# EAGLE board Backplane (EAGLE 9.6.2), part 1 of 2
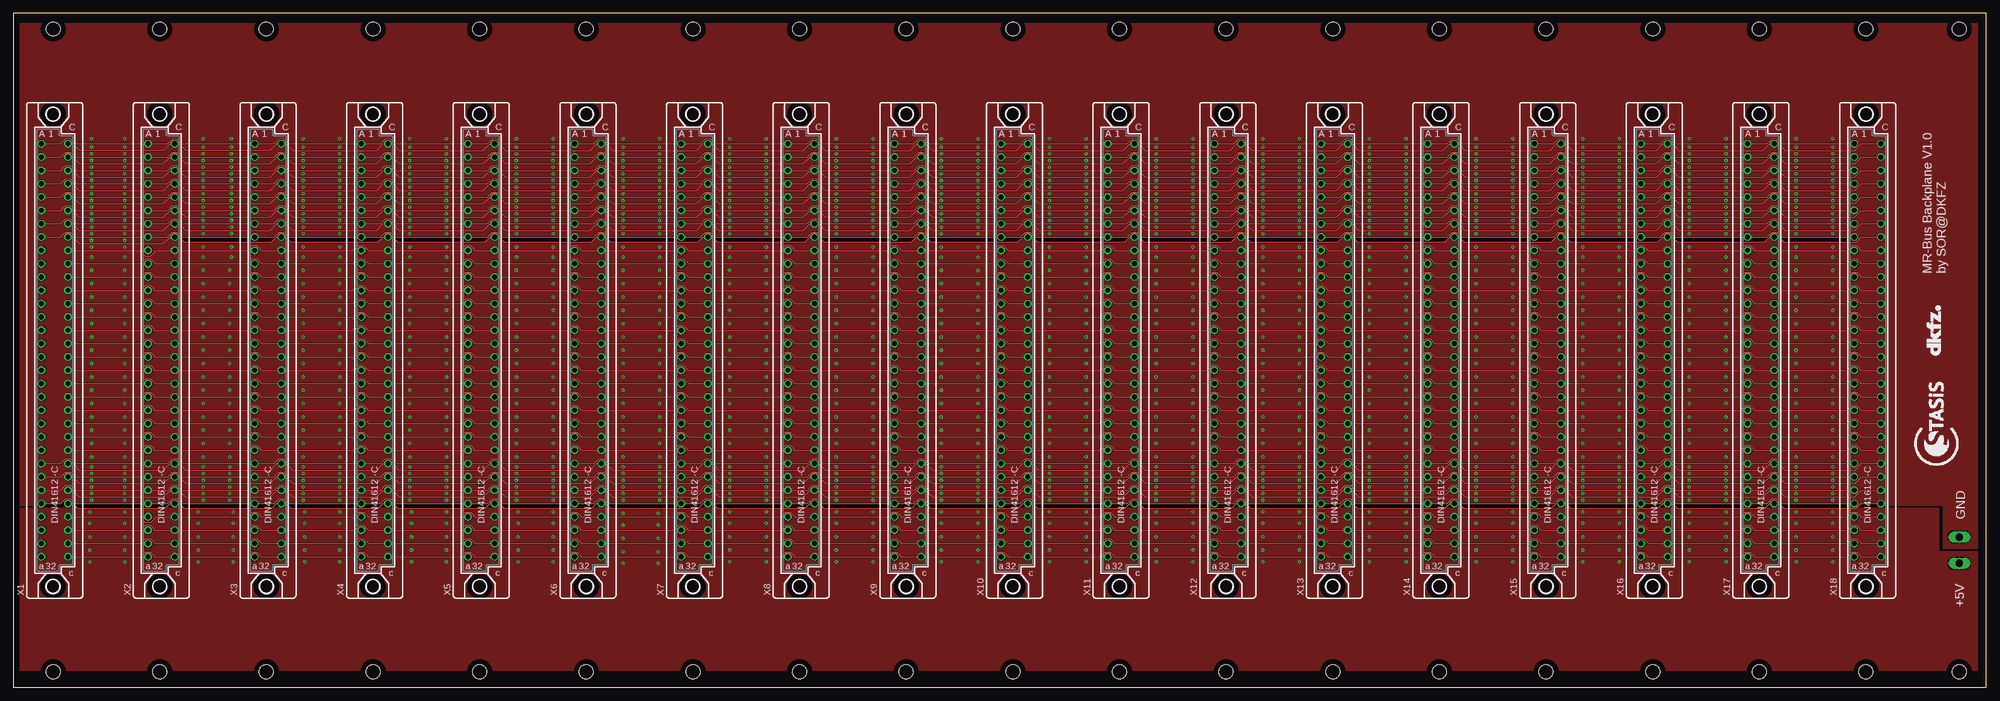
[diagram p2: board, top side]
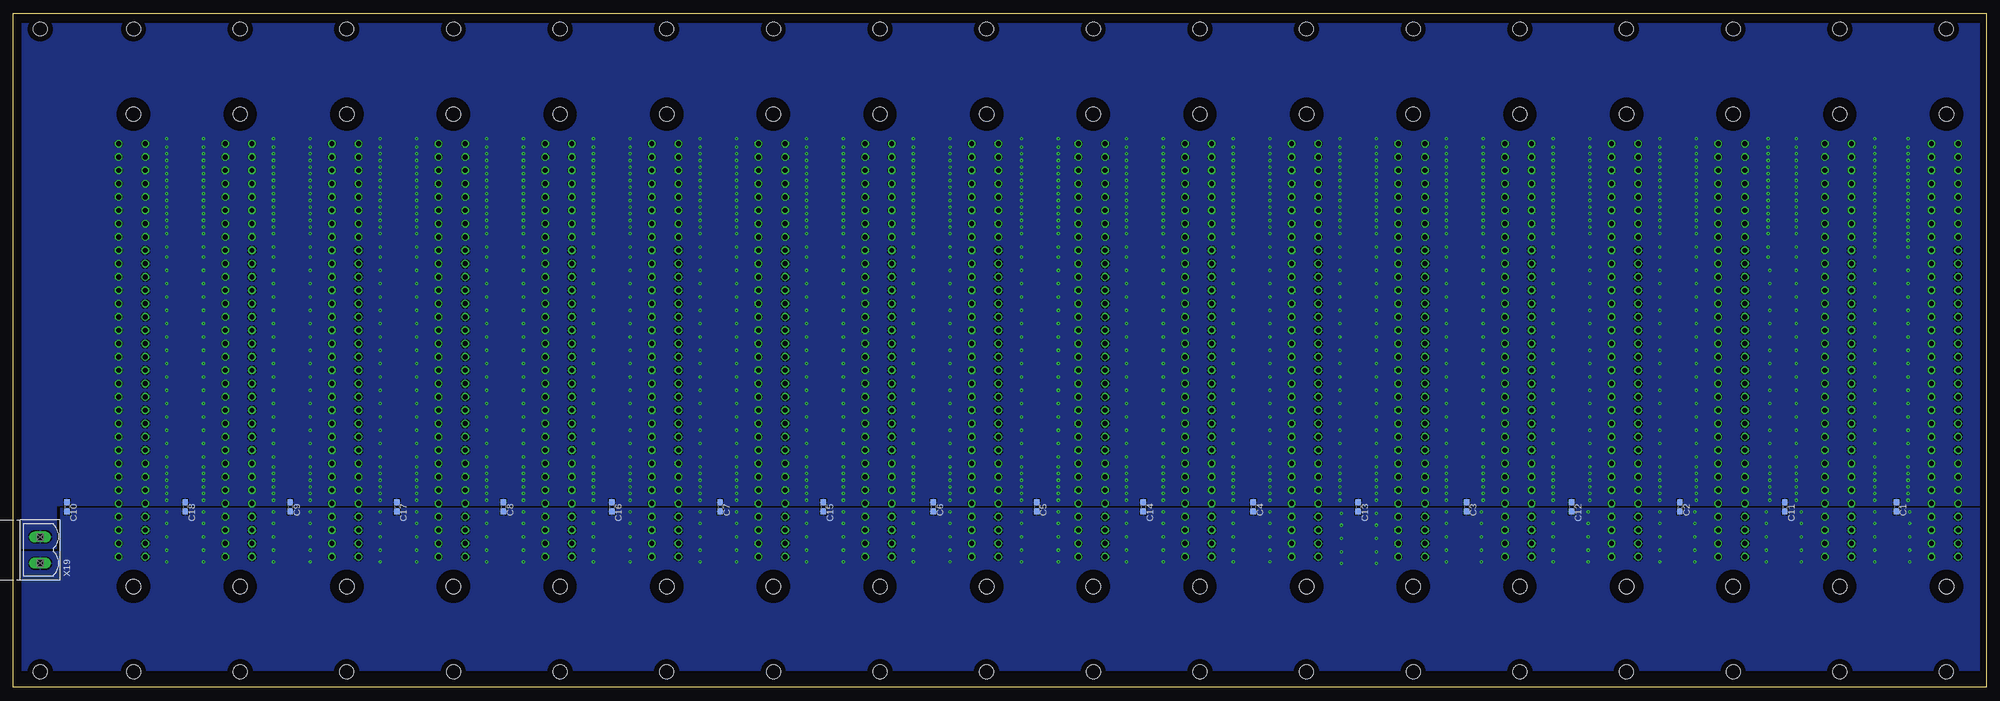
[diagram p3: board, bottom side, seen from below]

Size 376 x 128.55 mm. Coordinates in mm from the lower left corner, seen from the top.
Outline: 0,0 376,0 376,128.55 0,128.55 0,0
Copper layers (1*16): Top 0.035mm / dielectric 1.5mm / Bottom 0.035mm
Design rules "default *": minimum track width 6mil, minimum drill 0.2mm, track to track 4mil, track to pad 4mil, pad to pad 4mil, via to via 4mil, smd to smd 4mil, copper to edge 40mil, drill to drill 6mil, minimum pad ring 10mil, minimum via ring 8mil, stop-mask expansion 4mil, vias tented up to drill 8mil, thermal gap 10mil
Holes 2.7 mm at 7.62,3.03 27.94,3.03 48.26,3.03 68.58,3.03 88.9,3.03 109.22,3.03 129.54,3.03 149.86,3.03 170.18,3.03 190.5,3.03 210.82,3.03 231.14,3.03 251.46,3.03 271.78,3.03 292.1,3.03 312.42,3.03 332.74,3.03 353.06,3.03 370.84,3.03 7.62,125.53 27.94,125.53 48.26,125.53 68.58,125.53 88.9,125.53 109.22,125.53 129.54,125.53 149.86,125.53 170.18,125.53 190.5,125.53 210.82,125.53 231.14,125.53 251.46,125.53 271.78,125.53 292.1,125.53 312.42,125.53 332.74,125.53 353.06,125.53 370.84,125.53

## Footprints (pad centres in the part's own frame; a part is rotated, then mirrored left to right if it is on the bottom)
C0603 = smd 1.1 x 1: 1 -0.85,0; 2 0.85,0
FAC64S = drill 0.914 octagon: A1 -2.54,39.37; A2 -2.54,36.83; A3 -2.54,34.29; A4 -2.54,31.75; A5 -2.54,29.21; A6 -2.54,26.67; A7 -2.54,24.13; A8 -2.54,21.59; A9 -2.54,19.05; A10 -2.54,16.51; A11 -2.54,13.97; A12 -2.54,11.43; A13 -2.54,8.89; A14 -2.54,6.35; A15 -2.54,3.81; A16 -2.54,1.27; A17 -2.54,-1.27; A18 -2.54,-3.81; A19 -2.54,-6.35; A20 -2.54,-8.89; A21 -2.54,-11.43; A22 -2.54,-13.97; A23 -2.54,-16.51; A24 -2.54,-19.05; A25 -2.54,-21.59; A26 -2.54,-24.13; A27 -2.54,-26.67; A28 -2.54,-29.21; A29 -2.54,-31.75; A30 -2.54,-34.29; A31 -2.54,-36.83; A32 -2.54,-39.37; C1 2.54,39.37; C2 2.54,36.83; C3 2.54,34.29; C4 2.54,31.75; C5 2.54,29.21; C6 2.54,26.67; C7 2.54,24.13; C8 2.54,21.59; C9 2.54,19.05; C10 2.54,16.51; C11 2.54,13.97; C12 2.54,11.43; C13 2.54,8.89; C14 2.54,6.35; C15 2.54,3.81; C16 2.54,1.27; C17 2.54,-1.27; C18 2.54,-3.81; C19 2.54,-6.35; C20 2.54,-8.89; C21 2.54,-11.43; C22 2.54,-13.97; C23 2.54,-16.51; C24 2.54,-19.05; C25 2.54,-21.59; C26 2.54,-24.13; C27 2.54,-26.67; C28 2.54,-29.21; C29 2.54,-31.75; C30 2.54,-34.29; C31 2.54,-36.83; C32 2.54,-39.37 | hole 2.794: -0.305,45.009; -0.305,-45.009
MSTBV2 = drill 1.397 long: 1 -2.5,0; 2 2.5,0

## Placement (x,y rotation side)
C1  10nF  [C0603]  17.14,34.43 270 bottom
C2  10nF  [C0603]  58.42,34.43 270 bottom
C3  10nF  [C0603]  99.06,34.43 270 bottom
C4  10nF  [C0603]  139.7,34.43 270 bottom
C5  10nF  [C0603]  180.97,34.43 270 bottom
C6  10nF  [C0603]  200.66,34.43 270 bottom
C7  10nF  [C0603]  241.3,34.43 270 bottom
C8  10nF  [C0603]  282.57,34.43 270 bottom
C9  10nF  [C0603]  323.21,34.43 270 bottom
C10  10nF  [C0603]  365.76,34.43 270 bottom
C11  10nF  [C0603]  38.42,34.43 270 bottom
C12  10nF  [C0603]  79.06,34.43 270 bottom
C13  10nF  [C0603]  119.7,34.43 270 bottom
C14  10nF  [C0603]  160.66,34.43 270 bottom
C15  10nF  [C0603]  221.62,34.43 270 bottom
C16  10nF  [C0603]  261.94,34.43 270 bottom
C17  10nF  [C0603]  302.89,34.43 270 bottom
C18  10nF  [C0603]  343.22,34.43 270 bottom
U$1  [LOGO_STASIS]  366.71,51.26 90 top
U$2  [LOGO_DKFZ]  367.35,63.32 90 top
X1  FAC64S  [FAC64S]  7.92,64.28 0 top
X2  FAC64S  [FAC64S]  28.24,64.28 0 top
X3  FAC64S  [FAC64S]  48.56,64.28 0 top
X4  FAC64S  [FAC64S]  68.88,64.28 0 top
X5  FAC64S  [FAC64S]  89.2,64.28 0 top
X6  FAC64S  [FAC64S]  109.52,64.28 0 top
X7  FAC64S  [FAC64S]  129.84,64.28 0 top
X8  FAC64S  [FAC64S]  150.16,64.28 0 top
X9  FAC64S  [FAC64S]  170.48,64.28 0 top
X10  FAC64S  [FAC64S]  190.8,64.28 0 top
X11  FAC64S  [FAC64S]  211.12,64.28 0 top
X12  FAC64S  [FAC64S]  231.44,64.28 0 top
X13  FAC64S  [FAC64S]  251.76,64.28 0 top
X14  FAC64S  [FAC64S]  272.08,64.28 0 top
X15  FAC64S  [FAC64S]  292.4,64.28 0 top
X16  FAC64S  [FAC64S]  312.72,64.28 0 top
X17  FAC64S  [FAC64S]  333.04,64.28 0 top
X18  FAC64S  [FAC64S]  353.36,64.28 0 top
X19  AKL320-2  [MSTBV2]  370.84,26.18 90 bottom

## Tracks (layer width: path | path; a pad name or v marks a point on that pad's centre or on a via)
5V  (via drill 0.2)
  other vias: 14.61,33.48 21.27,33.48 14.61,31.26 21.27,31.26 21.27,28.72 14.61,28.72 14.61,26.18 21.27,26.18 14.61,23.95 21.27,23.95 35.24,33.48 41.91,33.48 35.24,31.26 41.91,31.26 41.91,28.72 35.24,28.72 35.24,26.18 41.91,26.18 35.24,23.95 41.91,23.95 55.56,33.48 62.23,33.48 55.56,31.26 62.23,31.26 62.23,28.72 55.56,28.72 55.56,26.18 62.23,26.18 55.56,23.95 62.23,23.95 75.88,33.48 82.55,33.48 75.88,31.26 82.55,31.26 82.55,28.72 75.88,28.72 75.88,26.18 82.55,26.18 75.88,23.95 82.55,23.95 96.2,33.48 102.87,33.48 96.2,31.26 102.87,31.26 102.87,28.72 96.2,28.72 96.2,26.18 102.87,26.18 96.2,23.95 102.87,23.95 116.2,33.16 122.87,33.16 116.2,30.94 122.87,30.94 122.87,28.4 116.2,28.4 116.2,25.86 122.87,25.86 116.2,23.64 122.87,23.64 136.53,33.48 143.51,33.48 136.53,31.26 143.51,31.26 143.51,28.72 136.53,28.72 136.53,26.18 143.51,26.18 136.53,23.95 143.51,23.95 156.84,33.48 163.83,33.48 156.84,31.26 163.83,31.26 163.83,28.72 156.84,28.72 156.84,26.18 163.83,26.18 156.84,23.95 163.83,23.95 176.85,33.48 183.83,33.48 176.85,31.26 183.83,31.26 183.83,28.72 176.85,28.72 176.85,26.18 183.83,26.18 176.85,23.95 183.83,23.95 197.49,33.48 204.47,33.48 197.49,31.26 204.47,31.26 204.47,28.72 197.49,28.72 197.49,26.18 204.47,26.18 197.49,23.95 204.47,23.95 217.81,33.48 224.79,33.48 217.81,31.26 224.79,31.26 224.79,28.72 217.81,28.72 217.81,26.18 224.79,26.18 217.81,23.95 224.79,23.95 238.12,33.48 245.11,33.48 238.12,31.26 245.11,31.26 245.11,28.72 238.12,28.72 238.12,26.18 245.11,26.18 238.12,23.95 245.11,23.95 258.44,33.48 265.43,33.48 258.44,31.26 265.43,31.26 265.43,28.72 258.44,28.72 258.44,26.18 265.43,26.18 258.44,23.95 265.43,23.95 278.76,33.48 285.75,33.48 278.76,31.26 285.75,31.26 285.75,28.72 278.76,28.72 278.76,26.18 285.75,26.18 278.76,23.95 285.75,23.95 299.08,33.48 306.07,33.48 299.08,31.26 306.07,31.26 306.07,28.72 299.08,28.72 299.08,26.18 306.07,26.18 299.08,23.95 306.07,23.95 319.4,33.48 326.39,33.48 319.4,31.26 326.39,31.26 326.39,28.72 319.4,28.72 319.4,26.18 326.39,26.18 319.4,23.95 326.39,23.95 339.73,33.48 346.71,33.48 339.73,31.26 346.71,31.26 346.71,28.72 339.73,28.72 339.73,26.18 346.71,26.18 339.73,23.95 346.71,23.95
  pour Bottom: 374.33,3.32 1.27,3.32 1.27,34.11 367.03,34.11 367.03,25.86 374.33,25.86
  pour Top: 1.27,34.11 1.27,3.32 374.33,3.32 374.33,25.86 367.03,25.86 367.03,34.11
A6
  Top 0.2: X1.A6 9.1,90.95 10.06,91.91 10.86,91.91 11.82,90.95 X2.A6 29.42,90.95 30.38,91.91 31.18,91.91 32.14,90.95 X3.A6 49.74,90.95 50.7,91.91 51.5,91.91 52.46,90.95 X4.A6 70.06,90.95 71.02,91.91 71.82,91.91 72.78,90.95 X5.A6 90.38,90.95 91.34,91.91 92.14,91.91 93.1,90.95 X6.A6 110.7,90.95 111.66,91.91 112.46,91.91 113.42,90.95 X7.A6 131.02,90.95 131.98,91.91 132.78,91.91 133.74,90.95 X8.A6 151.34,90.95 152.3,91.91 153.1,91.91 154.06,90.95 X9.A6 171.66,90.95 172.62,91.91 173.42,91.91 174.38,90.95 X10.A6 191.98,90.95 192.94,91.91 193.74,91.91 194.7,90.95 X11.A6 212.3,90.95 213.26,91.91 214.06,91.91 215.02,90.95 X12.A6 232.62,90.95 233.58,91.91 234.38,91.91 235.34,90.95 X13.A6 252.94,90.95 253.9,91.91 254.7,91.91 255.66,90.95 X14.A6 273.26,90.95 274.22,91.91 275.02,91.91 275.98,90.95 X15.A6 293.58,90.95 294.54,91.91 295.34,91.91 296.3,90.95 X16.A6 313.9,90.95 314.86,91.91 315.66,91.91 316.62,90.95 X17.A6 334.22,90.95 335.18,91.91 335.98,91.91 336.94,90.95 X18.A6
A7
  Top 0.2: X1.A7 9.1,88.41 10.06,89.37 10.86,89.37 11.82,88.41 X2.A7 29.42,88.41 30.38,89.37 31.18,89.37 32.14,88.41 X3.A7 49.74,88.41 50.7,89.37 51.5,89.37 52.46,88.41 X4.A7 70.06,88.41 71.02,89.37 71.82,89.37 72.78,88.41 X5.A7 90.38,88.41 91.34,89.37 92.14,89.37 93.1,88.41 X6.A7 110.7,88.41 111.66,89.37 112.46,89.37 113.42,88.41 X7.A7 131.02,88.41 131.98,89.37 132.78,89.37 133.74,88.41 X8.A7 151.34,88.41 152.3,89.37 153.1,89.37 154.06,88.41 X9.A7 171.66,88.41 172.62,89.37 173.42,89.37 174.38,88.41 X10.A7 191.98,88.41 192.94,89.37 193.74,89.37 194.7,88.41 X11.A7 212.3,88.41 213.26,89.37 214.06,89.37 215.02,88.41 X12.A7 232.62,88.41 233.58,89.37 234.38,89.37 235.34,88.41 X13.A7 252.94,88.41 253.9,89.37 254.7,89.37 255.66,88.41 X14.A7 273.26,88.41 274.22,89.37 275.02,89.37 275.98,88.41 X15.A7 293.58,88.41 294.54,89.37 295.34,89.37 296.3,88.41 X16.A7 313.9,88.41 314.86,89.37 315.66,89.37 316.62,88.41 X17.A7 334.22,88.41 335.18,89.37 335.98,89.37 336.94,88.41 X18.A7
A25
  Top 0.2: X1.A25 9.1,42.69 10.06,43.65 10.86,43.65 11.82,42.69 X2.A25 29.42,42.69 30.38,43.65 31.18,43.65 32.14,42.69 X3.A25 49.74,42.69 50.7,43.65 51.5,43.65 52.46,42.69 X4.A25 70.06,42.69 71.02,43.65 71.82,43.65 72.78,42.69 X5.A25 90.38,42.69 91.34,43.65 92.14,43.65 93.1,42.69 X6.A25 110.7,42.69 111.66,43.65 112.46,43.65 113.42,42.69 X7.A25 131.02,42.69 131.98,43.65 132.78,43.65 133.74,42.69 X8.A25 151.34,42.69 152.3,43.65 153.1,43.65 154.06,42.69 X9.A25 171.66,42.69 172.62,43.65 173.42,43.65 174.38,42.69 X10.A25 191.98,42.69 192.94,43.65 193.74,43.65 194.7,42.69 X11.A25 212.3,42.69 213.26,43.65 214.06,43.65 215.02,42.69 X12.A25 232.62,42.69 233.58,43.65 234.38,43.65 235.34,42.69 X13.A25 252.94,42.69 253.9,43.65 254.7,43.65 255.66,42.69 X14.A25 273.26,42.69 274.22,43.65 275.02,43.65 275.98,42.69 X15.A25 293.58,42.69 294.54,43.65 295.34,43.65 296.3,42.69 X16.A25 313.9,42.69 314.86,43.65 315.66,43.65 316.62,42.69 X17.A25 334.22,42.69 335.18,43.65 335.98,43.65 336.94,42.69 X18.A25
ADDR0
  Top 0.2: X1.C17 24.34,63.01 25.3,63.97 26.1,63.97 27.06,63.01 X2.C17 44.66,63.01 45.62,63.97 46.42,63.97 47.38,63.01 X3.C17 64.98,63.01 65.94,63.97 66.74,63.97 67.7,63.01 X4.C17 85.3,63.01 86.26,63.97 87.06,63.97 88.02,63.01 X5.C17 105.62,63.01 106.58,63.97 107.38,63.97 108.34,63.01 X6.C17 125.94,63.01 126.9,63.97 127.7,63.97 128.66,63.01 X7.C17 146.26,63.01 147.22,63.97 148.02,63.97 148.98,63.01 X8.C17 166.58,63.01 167.54,63.97 168.34,63.97 169.3,63.01 X9.C17 186.9,63.01 187.86,63.97 188.66,63.97 189.62,63.01 X10.C17 207.22,63.01 208.18,63.97 208.98,63.97 209.94,63.01 X11.C17 227.54,63.01 228.5,63.97 229.3,63.97 230.26,63.01 X12.C17 247.86,63.01 248.82,63.97 249.62,63.97 250.58,63.01 X13.C17 268.18,63.01 269.14,63.97 269.94,63.97 270.9,63.01 X14.C17 288.5,63.01 289.46,63.97 290.26,63.97 291.22,63.01 X15.C17 308.82,63.01 309.78,63.97 310.58,63.97 311.54,63.01 X16.C17 329.14,63.01 330.1,63.97 330.9,63.97 331.86,63.01 X17.C17 349.46,63.01 350.42,63.97 351.22,63.97 352.18,63.01 X18.C17
ADDR1
  Top 0.2: X1.C18 24.34,60.47 25.3,61.43 26.1,61.43 27.06,60.47 X2.C18 44.66,60.47 45.62,61.43 46.42,61.43 47.38,60.47 X3.C18 64.98,60.47 65.94,61.43 66.74,61.43 67.7,60.47 X4.C18 85.3,60.47 86.26,61.43 87.06,61.43 88.02,60.47 X5.C18 105.62,60.47 106.58,61.43 107.38,61.43 108.34,60.47 X6.C18 125.94,60.47 126.9,61.43 127.7,61.43 128.66,60.47 X7.C18 146.26,60.47 147.22,61.43 148.02,61.43 148.98,60.47 X8.C18 166.58,60.47 167.54,61.43 168.34,61.43 169.3,60.47 X9.C18 186.9,60.47 187.86,61.43 188.66,61.43 189.62,60.47 X10.C18 207.22,60.47 208.18,61.43 208.98,61.43 209.94,60.47 X11.C18 227.54,60.47 228.5,61.43 229.3,61.43 230.26,60.47 X12.C18 247.86,60.47 248.82,61.43 249.62,61.43 250.58,60.47 X13.C18 268.18,60.47 269.14,61.43 269.94,61.43 270.9,60.47 X14.C18 288.5,60.47 289.46,61.43 290.26,61.43 291.22,60.47 X15.C18 308.82,60.47 309.78,61.43 310.58,61.43 311.54,60.47 X16.C18 329.14,60.47 330.1,61.43 330.9,61.43 331.86,60.47 X17.C18 349.46,60.47 350.42,61.43 351.22,61.43 352.18,60.47 X18.C18
ADDR2
  Top 0.2: X1.C19 24.34,57.93 25.3,58.89 26.1,58.89 27.06,57.93 X2.C19 44.66,57.93 45.62,58.89 46.42,58.89 47.38,57.93 X3.C19 64.98,57.93 65.94,58.89 66.74,58.89 67.7,57.93 X4.C19 85.3,57.93 86.26,58.89 87.06,58.89 88.02,57.93 X5.C19 105.62,57.93 106.58,58.89 107.38,58.89 108.34,57.93 X6.C19 125.94,57.93 126.9,58.89 127.7,58.89 128.66,57.93 X7.C19 146.26,57.93 147.22,58.89 148.02,58.89 148.98,57.93 X8.C19 166.58,57.93 167.54,58.89 168.34,58.89 169.3,57.93 X9.C19 186.9,57.93 187.86,58.89 188.66,58.89 189.62,57.93 X10.C19 207.22,57.93 208.18,58.89 208.98,58.89 209.94,57.93 X11.C19 227.54,57.93 228.5,58.89 229.3,58.89 230.26,57.93 X12.C19 247.86,57.93 248.82,58.89 249.62,58.89 250.58,57.93 X13.C19 268.18,57.93 269.14,58.89 269.94,58.89 270.9,57.93 X14.C19 288.5,57.93 289.46,58.89 290.26,58.89 291.22,57.93 X15.C19 308.82,57.93 309.78,58.89 310.58,58.89 311.54,57.93 X16.C19 329.14,57.93 330.1,58.89 330.9,58.89 331.86,57.93 X17.C19 349.46,57.93 350.42,58.89 351.22,58.89 352.18,57.93 X18.C19
ADDR3
  Top 0.2: X1.C20 24.34,55.39 25.3,56.35 26.1,56.35 27.06,55.39 X2.C20 44.66,55.39 45.62,56.35 46.42,56.35 47.38,55.39 X3.C20 64.98,55.39 65.94,56.35 66.74,56.35 67.7,55.39 X4.C20 85.3,55.39 86.26,56.35 87.06,56.35 88.02,55.39 X5.C20 105.62,55.39 106.58,56.35 107.38,56.35 108.34,55.39 X6.C20 125.94,55.39 126.9,56.35 127.7,56.35 128.66,55.39 X7.C20 146.26,55.39 147.22,56.35 148.02,56.35 148.98,55.39 X8.C20 166.58,55.39 167.54,56.35 168.34,56.35 169.3,55.39 X9.C20 186.9,55.39 187.86,56.35 188.66,56.35 189.62,55.39 X10.C20 207.22,55.39 208.18,56.35 208.98,56.35 209.94,55.39 X11.C20 227.54,55.39 228.5,56.35 229.3,56.35 230.26,55.39 X12.C20 247.86,55.39 248.82,56.35 249.62,56.35 250.58,55.39 X13.C20 268.18,55.39 269.14,56.35 269.94,56.35 270.9,55.39 X14.C20 288.5,55.39 289.46,56.35 290.26,56.35 291.22,55.39 X15.C20 308.82,55.39 309.78,56.35 310.58,56.35 311.54,55.39 X16.C20 329.14,55.39 330.1,56.35 330.9,56.35 331.86,55.39 X17.C20 349.46,55.39 350.42,56.35 351.22,56.35 352.18,55.39 X18.C20
ADDR4
  Top 0.2: X1.C21 24.34,52.85 25.3,53.81 26.1,53.81 27.06,52.85 X2.C21 44.66,52.85 45.62,53.81 46.42,53.81 47.38,52.85 X3.C21 64.98,52.85 65.94,53.81 66.74,53.81 67.7,52.85 X4.C21 85.3,52.85 86.26,53.81 87.06,53.81 88.02,52.85 X5.C21 105.62,52.85 106.58,53.81 107.38,53.81 108.34,52.85 X6.C21 125.94,52.85 126.9,53.81 127.7,53.81 128.66,52.85 X7.C21 146.26,52.85 147.22,53.81 148.02,53.81 148.98,52.85 X8.C21 166.58,52.85 167.54,53.81 168.34,53.81 169.3,52.85 X9.C21 186.9,52.85 187.86,53.81 188.66,53.81 189.62,52.85 X10.C21 207.22,52.85 208.18,53.81 208.98,53.81 209.94,52.85 X11.C21 227.54,52.85 228.5,53.81 229.3,53.81 230.26,52.85 X12.C21 247.86,52.85 248.82,53.81 249.62,53.81 250.58,52.85 X13.C21 268.18,52.85 269.14,53.81 269.94,53.81 270.9,52.85 X14.C21 288.5,52.85 289.46,53.81 290.26,53.81 291.22,52.85 X15.C21 308.82,52.85 309.78,53.81 310.58,53.81 311.54,52.85 X16.C21 329.14,52.85 330.1,53.81 330.9,53.81 331.86,52.85 X17.C21 349.46,52.85 350.42,53.81 351.22,53.81 352.18,52.85 X18.C21
ADDR5
  Top 0.2: X1.C22 24.34,50.31 25.3,51.27 26.1,51.27 27.06,50.31 X2.C22 44.66,50.31 45.62,51.27 46.42,51.27 47.38,50.31 X3.C22 64.98,50.31 65.94,51.27 66.74,51.27 67.7,50.31 X4.C22 85.3,50.31 86.26,51.27 87.06,51.27 88.02,50.31 X5.C22 105.62,50.31 106.58,51.27 107.38,51.27 108.34,50.31 X6.C22 125.94,50.31 126.9,51.27 127.7,51.27 128.66,50.31 X7.C22 146.26,50.31 147.22,51.27 148.02,51.27 148.98,50.31 X8.C22 166.58,50.31 167.54,51.27 168.34,51.27 169.3,50.31 X9.C22 186.9,50.31 187.86,51.27 188.66,51.27 189.62,50.31 X10.C22 207.22,50.31 208.18,51.27 208.98,51.27 209.94,50.31 X11.C22 227.54,50.31 228.5,51.27 229.3,51.27 230.26,50.31 X12.C22 247.86,50.31 248.82,51.27 249.62,51.27 250.58,50.31 X13.C22 268.18,50.31 269.14,51.27 269.94,51.27 270.9,50.31 X14.C22 288.5,50.31 289.46,51.27 290.26,51.27 291.22,50.31 X15.C22 308.82,50.31 309.78,51.27 310.58,51.27 311.54,50.31 X16.C22 329.14,50.31 330.1,51.27 330.9,51.27 331.86,50.31 X17.C22 349.46,50.31 350.42,51.27 351.22,51.27 352.18,50.31 X18.C22
ADDR6
  Top 0.2: X1.C23 24.34,47.77 25.3,48.73 26.1,48.73 27.06,47.77 X2.C23 44.66,47.77 45.62,48.73 46.42,48.73 47.38,47.77 X3.C23 64.98,47.77 65.94,48.73 66.74,48.73 67.7,47.77 X4.C23 85.3,47.77 86.26,48.73 87.06,48.73 88.02,47.77 X5.C23 105.62,47.77 106.58,48.73 107.38,48.73 108.34,47.77 X6.C23 125.94,47.77 126.9,48.73 127.7,48.73 128.66,47.77 X7.C23 146.26,47.77 147.22,48.73 148.02,48.73 148.98,47.77 X8.C23 166.58,47.77 167.54,48.73 168.34,48.73 169.3,47.77 X9.C23 186.9,47.77 187.86,48.73 188.66,48.73 189.62,47.77 X10.C23 207.22,47.77 208.18,48.73 208.98,48.73 209.94,47.77 X11.C23 227.54,47.77 228.5,48.73 229.3,48.73 230.26,47.77 X12.C23 247.86,47.77 248.82,48.73 249.62,48.73 250.58,47.77 X13.C23 268.18,47.77 269.14,48.73 269.94,48.73 270.9,47.77 X14.C23 288.5,47.77 289.46,48.73 290.26,48.73 291.22,47.77 X15.C23 308.82,47.77 309.78,48.73 310.58,48.73 311.54,47.77 X16.C23 329.14,47.77 330.1,48.73 330.9,48.73 331.86,47.77 X17.C23 349.46,47.77 350.42,48.73 351.22,48.73 352.18,47.77 X18.C23
ADDR7
  Top 0.2: X1.C24 24.34,45.23 25.3,46.19 26.1,46.19 27.06,45.23 X2.C24 44.66,45.23 45.62,46.19 46.42,46.19 47.38,45.23 X3.C24 64.98,45.23 65.94,46.19 66.74,46.19 67.7,45.23 X4.C24 85.3,45.23 86.26,46.19 87.06,46.19 88.02,45.23 X5.C24 105.62,45.23 106.58,46.19 107.38,46.19 108.34,45.23 X6.C24 125.94,45.23 126.9,46.19 127.7,46.19 128.66,45.23 X7.C24 146.26,45.23 147.22,46.19 148.02,46.19 148.98,45.23 X8.C24 166.58,45.23 167.54,46.19 168.34,46.19 169.3,45.23 X9.C24 186.9,45.23 187.86,46.19 188.66,46.19 189.62,45.23 X10.C24 207.22,45.23 208.18,46.19 208.98,46.19 209.94,45.23 X11.C24 227.54,45.23 228.5,46.19 229.3,46.19 230.26,45.23 X12.C24 247.86,45.23 248.82,46.19 249.62,46.19 250.58,45.23 X13.C24 268.18,45.23 269.14,46.19 269.94,46.19 270.9,45.23 X14.C24 288.5,45.23 289.46,46.19 290.26,46.19 291.22,45.23 X15.C24 308.82,45.23 309.78,46.19 310.58,46.19 311.54,45.23 X16.C24 329.14,45.23 330.1,46.19 330.9,46.19 331.86,45.23 X17.C24 349.46,45.23 350.42,46.19 351.22,46.19 352.18,45.23 X18.C24
C31
  Top 0.2: X1.C31 24.34,27.45 25.3,28.41 26.1,28.41 27.06,27.45 X2.C31 44.66,27.45 45.62,28.41 46.42,28.41 47.38,27.45 X3.C31 64.98,27.45 65.94,28.41 66.74,28.41 67.7,27.45 X4.C31 85.3,27.45 86.26,28.41 87.06,28.41 88.02,27.45 X5.C31 105.62,27.45 106.58,28.41 107.38,28.41 108.34,27.45 X6.C31 125.94,27.45 126.9,28.41 127.7,28.41 128.66,27.45 X7.C31 146.26,27.45 147.22,28.41 148.02,28.41 148.98,27.45 X8.C31 166.58,27.45 167.54,28.41 168.34,28.41 169.3,27.45 X9.C31 186.9,27.45 187.86,28.41 188.66,28.41 189.62,27.45 X10.C31 207.22,27.45 208.18,28.41 208.98,28.41 209.94,27.45 X11.C31 227.54,27.45 228.5,28.41 229.3,28.41 230.26,27.45 X12.C31 247.86,27.45 248.82,28.41 249.62,28.41 250.58,27.45 X13.C31 268.18,27.45 269.14,28.41 269.94,28.41 270.9,27.45 X14.C31 288.5,27.45 289.46,28.41 290.26,28.41 291.22,27.45 X15.C31 308.82,27.45 309.78,28.41 310.58,28.41 311.54,27.45 X16.C31 329.14,27.45 330.1,28.41 330.9,28.41 331.86,27.45 X17.C31 349.46,27.45 350.42,28.41 351.22,28.41 352.18,27.45 X18.C31
CHIP0
  Top 0.2: X1.C25 11.32,42.69 12.61,41.4 28.64,41.4 29.92,42.69 X2.C25 31.64,42.69 32.92,41.4 48.95,41.4 50.24,42.69 X3.C25 51.96,42.69 53.24,41.4 69.28,41.4 70.56,42.69 X4.C25 72.28,42.69 73.56,41.4 89.59,41.4 90.88,42.69 X5.C25 92.6,42.69 93.89,41.4 109.92,41.4 111.2,42.69 X6.C25 112.92,42.69 114.2,41.4 130.24,41.4 131.52,42.69 X7.C25 133.24,42.69 134.53,41.4 150.56,41.4 151.84,42.69 X8.C25 153.56,42.69 154.84,41.4 170.88,41.4 172.16,42.69 X9.C25 173.88,42.69 175.16,41.4 191.19,41.4 192.48,42.69 X10.C25 194.2,42.69 195.49,41.4 211.51,41.4 212.8,42.69 X11.C25 214.52,42.69 215.81,41.4 231.84,41.4 233.12,42.69 X12.C25 234.84,42.69 236.12,41.4 252.16,41.4 253.44,42.69 X13.C25 255.16,42.69 256.44,41.4 272.48,41.4 273.76,42.69 X14.C25 275.48,42.69 276.76,41.4 292.8,41.4 294.08,42.69 X15.C25 295.8,42.69 297.08,41.4 313.12,41.4 314.4,42.69 X16.C25 316.12,42.69 317.4,41.4 333.44,41.4 334.72,42.69 X17.C25 336.44,42.69 337.73,41.4 350.9,41.4 352.18,42.69 X18.C25
CHIP1
  Top 0.2: X1.C26 11.32,40.15 12.61,38.86 28.64,38.86 29.92,40.15 X2.C26 31.64,40.15 32.92,38.86 48.95,38.86 50.24,40.15 X3.C26 51.96,40.15 53.24,38.86 69.28,38.86 70.56,40.15 X4.C26 72.28,40.15 73.56,38.86 89.59,38.86 90.88,40.15 X5.C26 92.6,40.15 93.89,38.86 109.92,38.86 111.2,40.15 X6.C26 112.92,40.15 114.2,38.86 130.24,38.86 131.52,40.15 X7.C26 133.24,40.15 134.53,38.86 150.56,38.86 151.84,40.15 X8.C26 153.56,40.15 154.84,38.86 170.88,38.86 172.16,40.15 X9.C26 173.88,40.15 175.16,38.86 191.19,38.86 192.48,40.15 X10.C26 194.2,40.15 195.49,38.86 211.51,38.86 212.8,40.15 X11.C26 214.52,40.15 215.81,38.86 231.84,38.86 233.12,40.15 X12.C26 234.84,40.15 236.12,38.86 252.16,38.86 253.44,40.15 X13.C26 255.16,40.15 256.44,38.86 272.48,38.86 273.76,40.15 X14.C26 275.48,40.15 276.76,38.86 292.8,38.86 294.08,40.15 X15.C26 295.8,40.15 297.08,38.86 313.12,38.86 314.4,40.15 X16.C26 316.12,40.15 317.4,38.86 333.44,38.86 334.72,40.15 X17.C26 336.44,40.15 337.73,38.86 350.9,38.86 352.18,40.15 X18.C26
CLK
  Top 0.2: X1.C29 24.13,32.53 25.21,31.45 26.19,31.45 27.27,32.53 X2.C29 44.66,32.53 45.62,33.49 46.42,33.49 47.38,32.53 X3.C29 64.98,32.53 65.94,33.49 66.74,33.49 67.7,32.53 X4.C29 85.3,32.53 86.26,33.49 87.06,33.49 88.02,32.53 X5.C29 105.62,32.53 106.58,33.49 107.38,33.49 108.34,32.53 X6.C29 125.94,32.53 126.9,33.49 127.7,33.49 128.66,32.53 X7.C29 146.26,32.53 147.22,33.49 148.02,33.49 148.98,32.53 X8.C29 166.58,32.53 167.54,33.49 168.34,33.49 169.3,32.53 X9.C29 186.9,32.53 187.86,33.49 188.66,33.49 189.62,32.53 X10.C29 207.22,32.53 208.18,33.49 208.98,33.49 209.94,32.53 X11.C29 227.54,32.53 228.5,33.49 229.3,33.49 230.26,32.53 X12.C29 247.86,32.53 248.82,33.49 249.62,33.49 250.58,32.53 X13.C29 268.18,32.53 269.14,33.49 269.94,33.49 270.9,32.53 X14.C29 288.5,32.53 289.46,33.49 290.26,33.49 291.22,32.53 X15.C29 308.82,32.53 309.78,33.49 310.58,33.49 311.54,32.53 X16.C29 329.14,32.53 330.1,33.49 330.9,33.49 331.86,32.53 X17.C29 349.46,32.53 350.42,33.49 351.22,33.49 352.18,32.53 X18.C29
DATA0
  Top 0.2: X1.C1 11.32,103.65 12.59,102.38 28.65,102.38 29.92,103.65 X2.C1 31.64,103.65 32.91,102.38 48.97,102.38 50.24,103.65 X3.C1 51.96,103.65 53.24,102.36 69.28,102.36 70.56,103.65 X4.C1 72.28,103.65 73.56,102.36 89.59,102.36 90.88,103.65 X5.C1 92.6,103.65 93.89,102.36 109.92,102.36 111.2,103.65 X6.C1 112.92,103.65 114.2,102.36 130.24,102.36 131.52,103.65 X7.C1 133.24,103.65 134.53,102.36 150.56,102.36 151.84,103.65 X8.C1 153.56,103.65 154.84,102.36 170.88,102.36 172.16,103.65 X9.C1 173.88,103.65 175.16,102.36 191.19,102.36 192.48,103.65 X10.C1 194.2,103.65 195.49,102.36 211.51,102.36 212.8,103.65 X11.C1 214.52,103.65 215.81,102.36 231.84,102.36 233.12,103.65 X12.C1 234.84,103.65 236.12,102.36 252.16,102.36 253.44,103.65 X13.C1 255.16,103.65 256.44,102.36 272.48,102.36 273.76,103.65 X14.C1 275.48,103.65 276.76,102.36 292.8,102.36 294.08,103.65 X15.C1 295.8,103.65 297.08,102.36 313.12,102.36 314.4,103.65 X16.C1 316.12,103.65 317.4,102.36 333.44,102.36 334.72,103.65 X17.C1 336.44,103.65 337.73,102.36 350.9,102.36 352.18,103.65 X18.C1
DATA1
  Top 0.2: X1.C2 11.32,101.11 12.61,99.82 28.64,99.82 29.92,101.11 X2.C2 31.64,101.11 32.92,99.82 48.95,99.82 50.24,101.11 X3.C2 51.96,101.11 53.24,99.82 69.28,99.82 70.56,101.11 X4.C2 72.28,101.11 73.56,99.82 89.59,99.82 90.88,101.11 X5.C2 92.6,101.11 93.89,99.82 109.92,99.82 111.2,101.11 X6.C2 112.92,101.11 114.2,99.82 130.24,99.82 131.52,101.11 X7.C2 133.24,101.11 134.53,99.82 150.56,99.82 151.84,101.11 X8.C2 153.56,101.11 154.84,99.82 170.88,99.82 172.16,101.11 X9.C2 173.88,101.11 175.16,99.82 191.19,99.82 192.48,101.11 X10.C2 194.2,101.11 195.49,99.82 211.51,99.82 212.8,101.11 X11.C2 214.52,101.11 215.81,99.82 231.84,99.82 233.12,101.11 X12.C2 234.84,101.11 236.12,99.82 252.16,99.82 253.44,101.11 X13.C2 255.16,101.11 256.44,99.82 272.48,99.82 273.76,101.11 X14.C2 275.48,101.11 276.76,99.82 292.8,99.82 294.08,101.11 X15.C2 295.8,101.11 297.08,99.82 313.12,99.82 314.4,101.11 X16.C2 316.12,101.11 317.4,99.82 333.44,99.82 334.72,101.11 X17.C2 336.44,101.11 337.73,99.82 350.9,99.82 352.18,101.11 X18.C2
DATA2
  Top 0.2: X1.C3 11.32,98.56 12.61,97.28 28.64,97.28 29.92,98.56 X2.C3 31.64,98.56 32.92,97.28 48.95,97.28 50.24,98.56 X3.C3 51.96,98.56 53.24,97.28 69.28,97.28 70.56,98.56 X4.C3 72.28,98.56 73.56,97.28 89.59,97.28 90.88,98.56 X5.C3 92.6,98.56 93.89,97.28 109.92,97.28 111.2,98.56 X6.C3 112.92,98.56 114.2,97.28 130.24,97.28 131.52,98.56 X7.C3 133.24,98.56 134.53,97.28 150.56,97.28 151.84,98.56 X8.C3 153.56,98.56 154.84,97.28 170.88,97.28 172.16,98.56 X9.C3 173.88,98.56 175.16,97.28 191.19,97.28 192.48,98.56 X10.C3 194.2,98.56 195.49,97.28 211.51,97.28 212.8,98.56 X11.C3 214.52,98.56 215.81,97.28 231.84,97.28 233.12,98.56 X12.C3 234.84,98.56 236.12,97.28 252.16,97.28 253.44,98.56 X13.C3 255.16,98.56 256.44,97.28 272.48,97.28 273.76,98.56 X14.C3 275.48,98.56 276.76,97.28 292.8,97.28 294.08,98.56 X15.C3 295.8,98.56 297.08,97.28 313.12,97.28 314.4,98.56 X16.C3 316.12,98.56 317.4,97.28 333.44,97.28 334.72,98.56 X17.C3 336.44,98.56 337.73,97.28 350.9,97.28 352.18,98.56 X18.C3
DATA3
  Top 0.2: X1.C4 11.32,96.03 12.61,94.74 28.64,94.74 29.92,96.03 X2.C4 31.64,96.03 32.92,94.74 48.95,94.74 50.24,96.03 X3.C4 51.96,96.03 53.24,94.74 69.28,94.74 70.56,96.03 X4.C4 72.28,96.03 73.56,94.74 89.59,94.74 90.88,96.03 X5.C4 92.6,96.03 93.89,94.74 109.92,94.74 111.2,96.03 X6.C4 112.92,96.03 114.2,94.74 130.24,94.74 131.52,96.03 X7.C4 133.24,96.03 134.53,94.74 150.56,94.74 151.84,96.03 X8.C4 153.56,96.03 154.84,94.74 170.88,94.74 172.16,96.03 X9.C4 173.88,96.03 175.16,94.74 191.19,94.74 192.48,96.03 X10.C4 194.2,96.03 195.49,94.74 211.51,94.74 212.8,96.03 X11.C4 214.52,96.03 215.81,94.74 231.84,94.74 233.12,96.03 X12.C4 234.84,96.03 236.12,94.74 252.16,94.74 253.44,96.03 X13.C4 255.16,96.03 256.44,94.74 272.48,94.74 273.76,96.03 X14.C4 275.48,96.03 276.76,94.74 292.8,94.74 294.08,96.03 X15.C4 295.8,96.03 297.08,94.74 313.12,94.74 314.4,96.03 X16.C4 316.12,96.03 317.4,94.74 333.44,94.74 334.72,96.03 X17.C4 336.44,96.03 337.73,94.74 350.9,94.74 352.18,96.03 X18.C4
DATA4
  Top 0.2: X1.C5 11.32,93.49 12.61,92.2 28.64,92.2 29.92,93.49 X2.C5 31.64,93.49 32.92,92.2 48.95,92.2 50.24,93.49 X3.C5 51.96,93.49 53.24,92.2 69.28,92.2 70.56,93.49 X4.C5 72.28,93.49 73.56,92.2 89.59,92.2 90.88,93.49 X5.C5 92.6,93.49 93.89,92.2 109.92,92.2 111.2,93.49 X6.C5 112.92,93.49 114.2,92.2 130.24,92.2 131.52,93.49 X7.C5 133.24,93.49 134.53,92.2 150.56,92.2 151.84,93.49 X8.C5 153.56,93.49 154.84,92.2 170.88,92.2 172.16,93.49 X9.C5 173.88,93.49 175.16,92.2 191.19,92.2 192.48,93.49 X10.C5 194.2,93.49 195.49,92.2 211.51,92.2 212.8,93.49 X11.C5 214.52,93.49 215.81,92.2 231.84,92.2 233.12,93.49 X12.C5 234.84,93.49 236.12,92.2 252.16,92.2 253.44,93.49 X13.C5 255.16,93.49 256.44,92.2 272.48,92.2 273.76,93.49 X14.C5 275.48,93.49 276.76,92.2 292.8,92.2 294.08,93.49 X15.C5 295.8,93.49 297.08,92.2 313.12,92.2 314.4,93.49 X16.C5 316.12,93.49 317.4,92.2 333.44,92.2 334.72,93.49 X17.C5 336.44,93.49 337.73,92.2 350.9,92.2 352.18,93.49 X18.C5
DATA5
  Top 0.2: X1.C6 11.32,90.95 12.61,89.66 28.64,89.66 29.92,90.95 X2.C6 31.64,90.95 32.92,89.66 48.95,89.66 50.24,90.95 X3.C6 51.96,90.95 53.24,89.66 69.28,89.66 70.56,90.95 X4.C6 72.28,90.95 73.56,89.66 89.59,89.66 90.88,90.95 X5.C6 92.6,90.95 93.89,89.66 109.92,89.66 111.2,90.95 X6.C6 112.92,90.95 114.2,89.66 130.24,89.66 131.52,90.95 X7.C6 133.24,90.95 134.53,89.66 150.56,89.66 151.84,90.95 X8.C6 153.56,90.95 154.84,89.66 170.88,89.66 172.16,90.95 X9.C6 173.88,90.95 175.16,89.66 191.19,89.66 192.48,90.95 X10.C6 194.2,90.95 195.49,89.66 211.51,89.66 212.8,90.95 X11.C6 214.52,90.95 215.81,89.66 231.84,89.66 233.12,90.95 X12.C6 234.84,90.95 236.12,89.66 252.16,89.66 253.44,90.95 X13.C6 255.16,90.95 256.44,89.66 272.48,89.66 273.76,90.95 X14.C6 275.48,90.95 276.76,89.66 292.8,89.66 294.08,90.95 X15.C6 295.8,90.95 297.08,89.66 313.12,89.66 314.4,90.95 X16.C6 316.12,90.95 317.4,89.66 333.44,89.66 334.72,90.95 X17.C6 336.44,90.95 337.73,89.66 350.9,89.66 352.18,90.95 X18.C6
DATA6
  Top 0.2: X1.C7 11.32,88.41 12.61,87.12 28.64,87.12 29.92,88.41 X2.C7 31.64,88.41 32.92,87.12 48.95,87.12 50.24,88.41 X3.C7 51.96,88.41 53.24,87.12 69.28,87.12 70.56,88.41 X4.C7 72.28,88.41 73.56,87.12 89.59,87.12 90.88,88.41 X5.C7 92.6,88.41 93.89,87.12 109.92,87.12 111.2,88.41 X6.C7 112.92,88.41 114.2,87.12 130.24,87.12 131.52,88.41 X7.C7 133.24,88.41 134.53,87.12 150.56,87.12 151.84,88.41 X8.C7 153.56,88.41 154.84,87.12 170.88,87.12 172.16,88.41 X9.C7 173.88,88.41 175.16,87.12 191.19,87.12 192.48,88.41 X10.C7 194.2,88.41 195.49,87.12 211.51,87.12 212.8,88.41 X11.C7 214.52,88.41 215.81,87.12 231.84,87.12 233.12,88.41 X12.C7 234.84,88.41 236.12,87.12 252.16,87.12 253.44,88.41 X13.C7 255.16,88.41 256.44,87.12 272.48,87.12 273.76,88.41 X14.C7 275.48,88.41 276.76,87.12 292.8,87.12 294.08,88.41 X15.C7 295.8,88.41 297.08,87.12 313.12,87.12 314.4,88.41 X16.C7 316.12,88.41 317.4,87.12 333.44,87.12 334.72,88.41 X17.C7 336.44,88.41 337.73,87.12 350.9,87.12 352.18,88.41 X18.C7
DATA7
  Top 0.2: X1.C8 11.32,85.87 12.61,84.58 28.64,84.58 29.92,85.87 X2.C8 31.64,85.87 32.61,84.9 49.27,84.9 50.24,85.87 X3.C8 51.96,85.87 52.93,84.9 69.59,84.9 70.56,85.87 X4.C8 72.28,85.87 73.25,84.9 89.91,84.9 90.88,85.87 X5.C8 92.6,85.87 93.57,84.9 110.23,84.9 111.2,85.87 X6.C8 112.92,85.87 113.89,84.9 130.55,84.9 131.52,85.87 X7.C8 133.24,85.87 134.21,84.9 150.87,84.9 151.84,85.87 X8.C8 153.56,85.87 154.53,84.9 171.19,84.9 172.16,85.87 X9.C8 173.88,85.87 174.85,84.9 191.51,84.9 192.48,85.87 X10.C8 194.2,85.87 195.17,84.9 211.83,84.9 212.8,85.87 X11.C8 214.52,85.87 215.49,84.9 232.15,84.9 233.12,85.87 X12.C8 234.84,85.87 235.81,84.9 252.47,84.9 253.44,85.87 X13.C8 255.16,85.87 256.13,84.9 272.79,84.9 273.76,85.87 X14.C8 275.48,85.87 276.45,84.9 293.11,84.9 294.08,85.87 X15.C8 295.8,85.87 296.77,84.9 313.43,84.9 314.4,85.87 X16.C8 316.12,85.87 317.09,84.9 333.75,84.9 334.72,85.87 X17.C8 336.44,85.87 337.41,84.9 351.22,84.9 352.18,85.87 X18.C8
DATA8
  Top 0.2: X1.C9 24.13,83.33 25.21,82.25 26.23,82.25 27.3,83.33 X2.C9 44.66,83.33 45.62,84.29 46.42,84.29 47.38,83.33 X3.C9 64.98,83.33 65.94,84.29 66.74,84.29 67.7,83.33 X4.C9 85.3,83.33 86.26,84.29 87.06,84.29 88.02,83.33 X5.C9 105.62,83.33 106.58,84.29 107.38,84.29 108.34,83.33 X6.C9 125.94,83.33 126.9,84.29 127.7,84.29 128.66,83.33 X7.C9 146.26,83.33 147.22,84.29 148.02,84.29 148.98,83.33 X8.C9 166.58,83.33 167.54,84.29 168.34,84.29 169.3,83.33 X9.C9 186.9,83.33 187.86,84.29 188.66,84.29 189.62,83.33 X10.C9 207.22,83.33 208.18,84.29 208.98,84.29 209.94,83.33 X11.C9 227.54,83.33 228.5,84.29 229.3,84.29 230.26,83.33 X12.C9 247.86,83.33 248.82,84.29 249.62,84.29 250.58,83.33 X13.C9 268.18,83.33 269.14,84.29 269.94,84.29 270.9,83.33 X14.C9 288.5,83.33 289.46,84.29 290.26,84.29 291.22,83.33 X15.C9 308.82,83.33 309.78,84.29 310.58,84.29 311.54,83.33 X16.C9 329.14,83.33 330.1,84.29 330.9,84.29 331.86,83.33 X17.C9 349.46,83.33 350.42,84.29 351.22,84.29 352.18,83.33 X18.C9
DATA9
  Top 0.2: X1.C10 24.34,80.79 25.3,81.75 26.1,81.75 27.06,80.79 X2.C10 44.66,80.79 45.62,81.75 46.42,81.75 47.38,80.79 X3.C10 64.98,80.79 65.94,81.75 66.74,81.75 67.7,80.79 X4.C10 85.3,80.79 86.26,81.75 87.06,81.75 88.02,80.79 X5.C10 105.62,80.79 106.58,81.75 107.38,81.75 108.34,80.79 X6.C10 125.94,80.79 126.9,81.75 127.7,81.75 128.66,80.79 X7.C10 146.26,80.79 147.22,81.75 148.02,81.75 148.98,80.79 X8.C10 166.58,80.79 167.54,81.75 168.34,81.75 169.3,80.79 X9.C10 186.9,80.79 187.86,81.75 188.66,81.75 189.62,80.79 X10.C10 207.22,80.79 208.18,81.75 208.98,81.75 209.94,80.79 X11.C10 227.54,80.79 228.5,81.75 229.3,81.75 230.26,80.79 X12.C10 247.86,80.79 248.82,81.75 249.62,81.75 250.58,80.79 X13.C10 268.18,80.79 269.14,81.75 269.94,81.75 270.9,80.79 X14.C10 288.5,80.79 289.46,81.75 290.26,81.75 291.22,80.79 X15.C10 308.82,80.79 309.78,81.75 310.58,81.75 311.54,80.79 X16.C10 329.14,80.79 330.1,81.75 330.9,81.75 331.86,80.79 X17.C10 349.46,80.79 350.42,81.75 351.22,81.75 352.18,80.79 X18.C10
DATA10
  Top 0.2: X1.C11 24.34,78.25 25.3,79.21 26.1,79.21 27.06,78.25 X2.C11 44.66,78.25 45.62,79.21 46.42,79.21 47.38,78.25 X3.C11 64.98,78.25 65.94,79.21 66.74,79.21 67.7,78.25 X4.C11 85.3,78.25 86.26,79.21 87.06,79.21 88.02,78.25 X5.C11 105.62,78.25 106.58,79.21 107.38,79.21 108.34,78.25 X6.C11 125.94,78.25 126.9,79.21 127.7,79.21 128.66,78.25 X7.C11 146.26,78.25 147.22,79.21 148.02,79.21 148.98,78.25 X8.C11 166.58,78.25 167.54,79.21 168.34,79.21 169.3,78.25 X9.C11 186.9,78.25 187.86,79.21 188.66,79.21 189.62,78.25 X10.C11 207.22,78.25 208.18,79.21 208.98,79.21 209.94,78.25 X11.C11 227.54,78.25 228.5,79.21 229.3,79.21 230.26,78.25 X12.C11 247.86,78.25 248.82,79.21 249.62,79.21 250.58,78.25 X13.C11 268.18,78.25 269.14,79.21 269.94,79.21 270.9,78.25 X14.C11 288.5,78.25 289.46,79.21 290.26,79.21 291.22,78.25 X15.C11 308.82,78.25 309.78,79.21 310.58,79.21 311.54,78.25 X16.C11 329.14,78.25 330.1,79.21 330.9,79.21 331.86,78.25 X17.C11 349.46,78.25 350.42,79.21 351.22,79.21 352.18,78.25 X18.C11
DATA11
  Top 0.2: X1.C12 24.34,75.71 25.3,76.67 26.1,76.67 27.06,75.71 X2.C12 44.66,75.71 45.62,76.67 46.42,76.67 47.38,75.71 X3.C12 64.98,75.71 65.94,76.67 66.74,76.67 67.7,75.71 X4.C12 85.3,75.71 86.26,76.67 87.06,76.67 88.02,75.71 X5.C12 105.62,75.71 106.58,76.67 107.38,76.67 108.34,75.71 X6.C12 125.94,75.71 126.9,76.67 127.7,76.67 128.66,75.71 X7.C12 146.26,75.71 147.22,76.67 148.02,76.67 148.98,75.71 X8.C12 166.58,75.71 167.54,76.67 168.34,76.67 169.3,75.71 X9.C12 186.9,75.71 187.86,76.67 188.66,76.67 189.62,75.71 X10.C12 207.22,75.71 208.18,76.67 208.98,76.67 209.94,75.71 X11.C12 227.54,75.71 228.5,76.67 229.3,76.67 230.26,75.71 X12.C12 247.86,75.71 248.82,76.67 249.62,76.67 250.58,75.71 X13.C12 268.18,75.71 269.14,76.67 269.94,76.67 270.9,75.71 X14.C12 288.5,75.71 289.46,76.67 290.26,76.67 291.22,75.71 X15.C12 308.82,75.71 309.78,76.67 310.58,76.67 311.54,75.71 X16.C12 329.14,75.71 330.1,76.67 330.9,76.67 331.86,75.71 X17.C12 349.46,75.71 350.42,76.67 351.22,76.67 352.18,75.71 X18.C12
DATA12
  Top 0.2: X1.C13 24.34,73.17 25.3,74.13 26.1,74.13 27.06,73.17 X2.C13 44.66,73.17 45.62,74.13 46.42,74.13 47.38,73.17 X3.C13 64.98,73.17 65.94,74.13 66.74,74.13 67.7,73.17 X4.C13 85.3,73.17 86.26,74.13 87.06,74.13 88.02,73.17 X5.C13 105.62,73.17 106.58,74.13 107.38,74.13 108.34,73.17 X6.C13 125.94,73.17 126.9,74.13 127.7,74.13 128.66,73.17 X7.C13 146.26,73.17 147.22,74.13 148.02,74.13 148.98,73.17 X8.C13 166.58,73.17 167.54,74.13 168.34,74.13 169.3,73.17 X9.C13 186.9,73.17 187.86,74.13 188.66,74.13 189.62,73.17 X10.C13 207.22,73.17 208.18,74.13 208.98,74.13 209.94,73.17 X11.C13 227.54,73.17 228.5,74.13 229.3,74.13 230.26,73.17 X12.C13 247.86,73.17 248.82,74.13 249.62,74.13 250.58,73.17 X13.C13 268.18,73.17 269.14,74.13 269.94,74.13 270.9,73.17 X14.C13 288.5,73.17 289.46,74.13 290.26,74.13 291.22,73.17 X15.C13 308.82,73.17 309.78,74.13 310.58,74.13 311.54,73.17 X16.C13 329.14,73.17 330.1,74.13 330.9,74.13 331.86,73.17 X17.C13 349.46,73.17 350.42,74.13 351.22,74.13 352.18,73.17 X18.C13
DATA13
  Top 0.2: X1.C14 24.34,70.62 25.3,71.59 26.1,71.59 27.06,70.62 X2.C14 44.66,70.62 45.62,71.59 46.42,71.59 47.38,70.62 X3.C14 64.98,70.62 65.94,71.59 66.74,71.59 67.7,70.62 X4.C14 85.3,70.62 86.26,71.59 87.06,71.59 88.02,70.62 X5.C14 105.62,70.62 106.58,71.59 107.38,71.59 108.34,70.62 X6.C14 125.94,70.62 126.9,71.59 127.7,71.59 128.66,70.62 X7.C14 146.26,70.62 147.22,71.59 148.02,71.59 148.98,70.62 X8.C14 166.58,70.62 167.54,71.59 168.34,71.59 169.3,70.62 X9.C14 186.9,70.62 187.86,71.59 188.66,71.59 189.62,70.62 X10.C14 207.22,70.62 208.18,71.59 208.98,71.59 209.94,70.62 X11.C14 227.54,70.62 228.5,71.59 229.3,71.59 230.26,70.62 X12.C14 247.86,70.62 248.82,71.59 249.62,71.59 250.58,70.62 X13.C14 268.18,70.62 269.14,71.59 269.94,71.59 270.9,70.62 X14.C14 288.5,70.62 289.46,71.59 290.26,71.59 291.22,70.62 X15.C14 308.82,70.62 309.78,71.59 310.58,71.59 311.54,70.62 X16.C14 329.14,70.62 330.1,71.59 330.9,71.59 331.86,70.62 X17.C14 349.46,70.62 350.42,71.59 351.22,71.59 352.18,70.62 X18.C14
DATA14
  Top 0.2: X1.C15 24.34,68.09 25.3,69.05 26.1,69.05 27.06,68.09 X2.C15 44.66,68.09 45.62,69.05 46.42,69.05 47.38,68.09 X3.C15 64.98,68.09 65.94,69.05 66.74,69.05 67.7,68.09 X4.C15 85.3,68.09 86.26,69.05 87.06,69.05 88.02,68.09 X5.C15 105.62,68.09 106.58,69.05 107.38,69.05 108.34,68.09 X6.C15 125.94,68.09 126.9,69.05 127.7,69.05 128.66,68.09 X7.C15 146.26,68.09 147.22,69.05 148.02,69.05 148.98,68.09 X8.C15 166.58,68.09 167.54,69.05 168.34,69.05 169.3,68.09 X9.C15 186.9,68.09 187.86,69.05 188.66,69.05 189.62,68.09 X10.C15 207.22,68.09 208.18,69.05 208.98,69.05 209.94,68.09 X11.C15 227.54,68.09 228.5,69.05 229.3,69.05 230.26,68.09 X12.C15 247.86,68.09 248.82,69.05 249.62,69.05 250.58,68.09 X13.C15 268.18,68.09 269.14,69.05 269.94,69.05 270.9,68.09 X14.C15 288.5,68.09 289.46,69.05 290.26,69.05 291.22,68.09 X15.C15 308.82,68.09 309.78,69.05 310.58,69.05 311.54,68.09 X16.C15 329.14,68.09 330.1,69.05 330.9,69.05 331.86,68.09 X17.C15 349.46,68.09 350.42,69.05 351.22,69.05 352.18,68.09 X18.C15
DATA15
  Top 0.2: X1.C16 24.34,65.55 25.3,66.51 26.1,66.51 27.06,65.55 X2.C16 44.66,65.55 45.62,66.51 46.42,66.51 47.38,65.55 X3.C16 64.98,65.55 65.94,66.51 66.74,66.51 67.7,65.55 X4.C16 85.3,65.55 86.26,66.51 87.06,66.51 88.02,65.55 X5.C16 105.62,65.55 106.58,66.51 107.38,66.51 108.34,65.55 X6.C16 125.94,65.55 126.9,66.51 127.7,66.51 128.66,65.55 X7.C16 146.26,65.55 147.22,66.51 148.02,66.51 148.98,65.55 X8.C16 166.58,65.55 167.54,66.51 168.34,66.51 169.3,65.55 X9.C16 186.9,65.55 187.86,66.51 188.66,66.51 189.62,65.55 X10.C16 207.22,65.55 208.18,66.51 208.98,66.51 209.94,65.55 X11.C16 227.54,65.55 228.5,66.51 229.3,66.51 230.26,65.55 X12.C16 247.86,65.55 248.82,66.51 249.62,66.51 250.58,65.55 X13.C16 268.18,65.55 269.14,66.51 269.94,66.51 270.9,65.55 X14.C16 288.5,65.55 289.46,66.51 290.26,66.51 291.22,65.55 X15.C16 308.82,65.55 309.78,66.51 310.58,66.51 311.54,65.55 X16.C16 329.14,65.55 330.1,66.51 330.9,66.51 331.86,65.55 X17.C16 349.46,65.55 350.42,66.51 351.22,66.51 352.18,65.55 X18.C16
ENABLE
  Top 0.2: X1.C32 24.34,24.91 25.3,25.87 26.1,25.87 27.06,24.91 X2.C32 44.66,24.91 45.62,25.87 46.42,25.87 47.38,24.91 X3.C32 64.98,24.91 65.94,25.87 66.74,25.87 67.7,24.91 X4.C32 85.3,24.91 86.26,25.87 87.06,25.87 88.02,24.91 X5.C32 105.62,24.91 106.58,25.87 107.38,25.87 108.34,24.91 X6.C32 125.94,24.91 126.9,25.87 127.7,25.87 128.66,24.91 X7.C32 146.26,24.91 147.22,25.87 148.02,25.87 148.98,24.91 X8.C32 166.58,24.91 167.54,25.87 168.34,25.87 169.3,24.91 X9.C32 186.9,24.91 187.86,25.87 188.66,25.87 189.62,24.91 X10.C32 207.22,24.91 208.18,25.87 208.98,25.87 209.94,24.91 X11.C32 227.54,24.91 228.5,25.87 229.3,25.87 230.26,24.91 X12.C32 247.86,24.91 248.82,25.87 249.62,25.87 250.58,24.91 X13.C32 268.18,24.91 269.14,25.87 269.94,25.87 270.9,24.91 X14.C32 288.5,24.91 289.46,25.87 290.26,25.87 291.22,24.91 X15.C32 308.82,24.91 309.78,25.87 310.58,25.87 311.54,24.91 X16.C32 329.14,24.91 330.1,25.87 330.9,25.87 331.86,24.91 X17.C32 349.46,24.91 350.42,25.87 351.22,25.87 352.18,24.91 X18.C32
EXT_MOD_CLK
  Top 0.2: X1.A26 9.1,40.15 10.06,41.11 10.86,41.11 11.82,40.15 X2.A26 29.42,40.15 30.38,41.11 31.18,41.11 32.14,40.15 X3.A26 49.74,40.15 50.7,41.11 51.5,41.11 52.46,40.15 X4.A26 70.06,40.15 71.02,41.11 71.82,41.11 72.78,40.15 X5.A26 90.38,40.15 91.34,41.11 92.14,41.11 93.1,40.15 X6.A26 110.7,40.15 111.66,41.11 112.46,41.11 113.42,40.15 X7.A26 131.02,40.15 131.98,41.11 132.78,41.11 133.74,40.15 X8.A26 151.34,40.15 152.3,41.11 153.1,41.11 154.06,40.15 X9.A26 171.66,40.15 172.62,41.11 173.42,41.11 174.38,40.15 X10.A26 191.98,40.15 192.94,41.11 193.74,41.11 194.7,40.15 X11.A26 212.3,40.15 213.26,41.11 214.06,41.11 215.02,40.15 X12.A26 232.62,40.15 233.58,41.11 234.38,41.11 235.34,40.15 X13.A26 252.94,40.15 253.9,41.11 254.7,41.11 255.66,40.15 X14.A26 273.26,40.15 274.22,41.11 275.02,41.11 275.98,40.15 X15.A26 293.58,40.15 294.54,41.11 295.34,41.11 296.3,40.15 X16.A26 313.9,40.15 314.86,41.11 315.66,41.11 316.62,40.15 X17.A26 334.22,40.15 335.18,41.11 335.98,41.11 336.94,40.15 X18.A26
GND  (via drill 0.2)